# Altium schematic sheet USB_Interface_SCH.SchDoc
size A
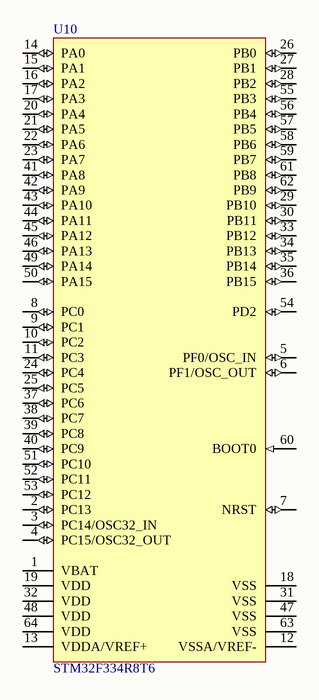
[diagram p0: USB_Interface_SCH.SchDoc]

## Parts
U10  STM32F334R8T6  [STM-LQFP64_L]

## Nets

Not connected (* = marked no-connect by the designer): U10 1(VBAT) 2(PC13) 3(PC14/OSC32_IN) 4(PC15/OSC32_OUT) 5(PF0/OSC_IN) 6(PF1/OSC_OUT) 7(NRST) 8(PC0) 9(PC1) 10(PC2) 11(PC3) 12(VSSA/VREF-) 13(VDDA/VREF+) 14(PA0) 15(PA1) 16(PA2) 17(PA3) 18(VSS) 19(VDD) 20(PA4) 21(PA5) 22(PA6) 23(PA7) 24(PC4) 25(PC5) 26(PB0) 27(PB1) 28(PB2) 29(PB10) 30(PB11) 31(VSS) 32(VDD) 33(PB12) 34(PB13) 35(PB14) 36(PB15) 37(PC6) 38(PC7) 39(PC8) 40(PC9) 41(PA8) 42(PA9) 43(PA10) 44(PA11) 45(PA12) 46(PA13) 47(VSS) 48(VDD) 49(PA14) 50(PA15) 51(PC10) 52(PC11) 53(PC12) 54(PD2) 55(PB3) 56(PB4) 57(PB5) 58(PB6) 59(PB7) 60(BOOT0) 61(PB8) 62(PB9) 63(VSS) 64(VDD)

## Library data of the parts
U10 = CMP-0537-00077-1: ARM Cortex-M4 32-bit MCU, 64 KB Flash, 16 KB Internal RAM, 51 I/Os, 64-Pin LQFP, -40 to 85 degC, Tray; Supply Voltage(Vcc) min (V): 2; D/A Converter: 3; Internal RAM Size (kB): 16; FLASH Size (Prog) (kB): 64; Operating Frequency(F) (Processor speed) (MHz): 72; I/Os (High Current): 51; ComponentLink1Description: Manufacturer URL; ComponentLink2URL: http://www.st.com/st-web-ui/static/active/en/resource/technical/document/datasheet/DM00097745.pdf; Package Reference: LQFP64; ComponentLink1URL: http://www.st.com/; ComponentLink2Description: Datasheet; DatasheetVersion: Rev. 4; Mounting Technology: Surface Mount; Package Description: 64-Pin Low-profile Quad Flat Package, Body 10 x 10 mm, Pitch 0.5 mm; Packing: Tray; Core: ARM Cortex-M4